# Altium project S7CAS-PLEIADES-CARTE-FILLE.PrjPCB (part 2 of 2)

## Sheet CF_FMC_DE.SchDoc
size Tabloid; DocumentNumber: 10; SheetNumber: 10; SheetTotal: 10; Sheet_Name: CF_FMC_DE; Size: 11x17
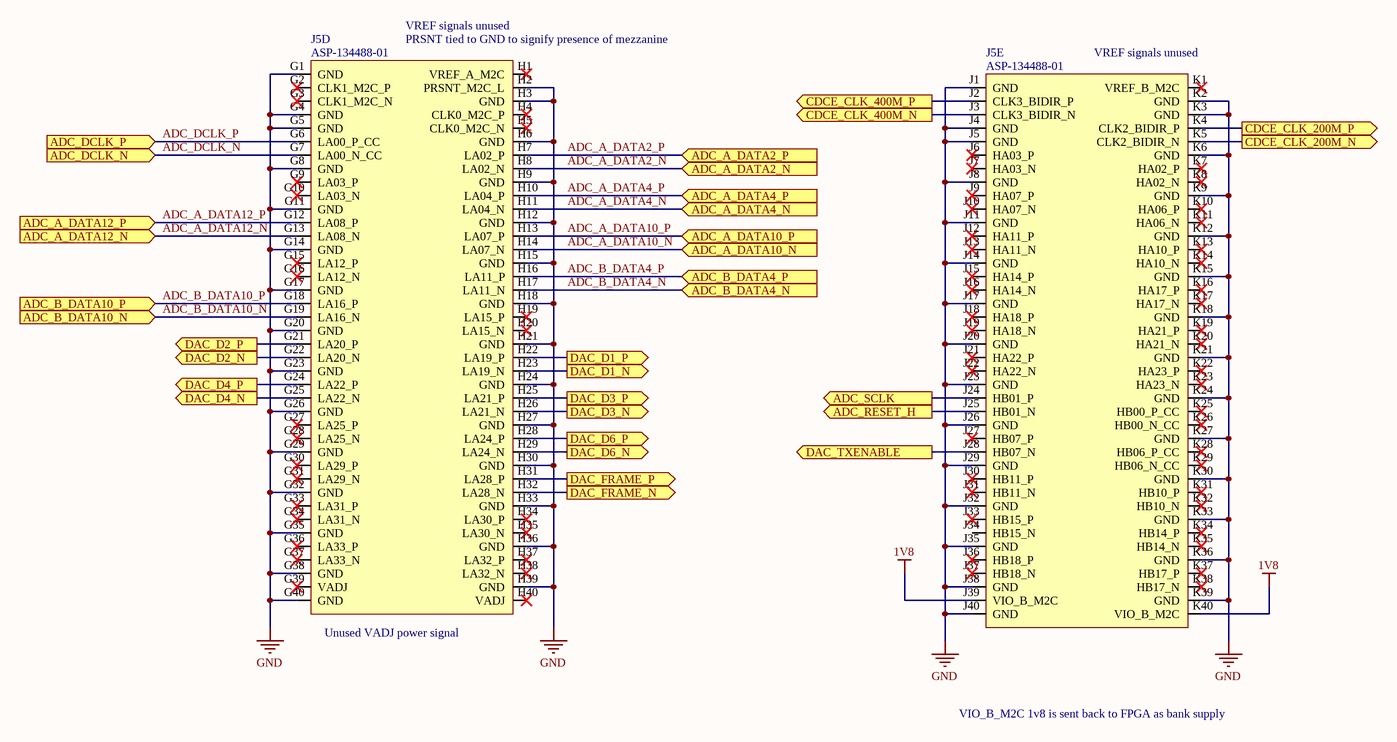
[diagram p9: CF_FMC_DE.SchDoc]

### Parts
J5  ASP-134488-01  [CONN_SAMTEC_ASP-134488-01]  (parts D,E of 5)

### Ports
ADC_A_DATA2_N (in), ADC_A_DATA2_P (in), ADC_A_DATA4_N (in), ADC_A_DATA4_P (in), ADC_A_DATA10_N (in), ADC_A_DATA10_P (in), ADC_A_DATA12_N (in), ADC_A_DATA12_P (in), ADC_B_DATA4_N (in), ADC_B_DATA4_P (in), ADC_B_DATA10_N (in), ADC_B_DATA10_P (in), ADC_DCLK_N (in), ADC_DCLK_P (in), ADC_RESET_H (out), ADC_SCLK (out), CDCE_CLK_200M_N (out), CDCE_CLK_200M_P (out), CDCE_CLK_400M_N (out), CDCE_CLK_400M_P (out), DAC_D1_N (out), DAC_D1_P (out), DAC_D2_N (out), DAC_D2_P (out), DAC_D3_N (out), DAC_D3_P (out), DAC_D4_N (out), DAC_D4_P (out), DAC_D6_N (out), DAC_D6_P (out), DAC_FRAME_N (out), DAC_FRAME_P (out), DAC_TXENABLE (out)

### Nets
1V8: J5.J39(VIO_B_M2C) J5.K40(VIO_B_M2C)
GND: J5.G1(GND) J5.G4(GND) J5.G5(GND) J5.G8(GND) J5.G11(GND) J5.G14(GND) J5.G17(GND) J5.G20(GND) J5.G23(GND) J5.G26(GND) J5.G29(GND) J5.G32(GND) J5.G35(GND) J5.G38(GND) J5.G40(GND) J5.H2(PRSNT_M2C_L) J5.H3(GND) J5.H6(GND) J5.H9(GND) J5.H12(GND) J5.H15(GND) J5.H18(GND) J5.H21(GND) J5.H24(GND) J5.H27(GND) J5.H30(GND) J5.H33(GND) J5.H36(GND) J5.H39(GND) J5.J1(GND) J5.J4(GND) J5.J5(GND) J5.J8(GND) J5.J11(GND) J5.J14(GND) J5.J17(GND) J5.J20(GND) J5.J23(GND) J5.J26(GND) J5.J29(GND) J5.J32(GND) J5.J35(GND) J5.J38(GND) J5.J40(GND) J5.K2(GND) J5.K3(GND) J5.K6(GND) J5.K9(GND) J5.K12(GND) J5.K15(GND) J5.K18(GND) J5.K21(GND) J5.K24(GND) J5.K27(GND) J5.K30(GND) J5.K33(GND) J5.K36(GND) J5.K39(GND)
ADC_A_DATA2_N: J5.H8(LA02_N) ; port ADC_A_DATA2_N
ADC_A_DATA2_P: J5.H7(LA02_P) ; port ADC_A_DATA2_P
ADC_A_DATA4_N: J5.H11(LA04_N) ; port ADC_A_DATA4_N
ADC_A_DATA4_P: J5.H10(LA04_P) ; port ADC_A_DATA4_P
ADC_A_DATA10_N: J5.H14(LA07_N) ; port ADC_A_DATA10_N
ADC_A_DATA10_P: J5.H13(LA07_P) ; port ADC_A_DATA10_P
ADC_A_DATA12_N: J5.G13(LA08_N) ; port ADC_A_DATA12_N
ADC_A_DATA12_P: J5.G12(LA08_P) ; port ADC_A_DATA12_P
ADC_B_DATA4_N: J5.H17(LA11_N) ; port ADC_B_DATA4_N
ADC_B_DATA4_P: J5.H16(LA11_P) ; port ADC_B_DATA4_P
ADC_B_DATA10_N: J5.G19(LA16_N) ; port ADC_B_DATA10_N
ADC_B_DATA10_P: J5.G18(LA16_P) ; port ADC_B_DATA10_P
ADC_DCLK_N: J5.G7(LA00_N_CC) ; port ADC_DCLK_N
ADC_DCLK_P: J5.G6(LA00_P_CC) ; port ADC_DCLK_P
DAC_D1_N: J5.H23(LA19_N) ; port DAC_D1_N
DAC_D1_P: J5.H22(LA19_P) ; port DAC_D1_P
DAC_D2_N: J5.G22(LA20_N) ; port DAC_D2_N
DAC_D2_P: J5.G21(LA20_P) ; port DAC_D2_P
DAC_D3_N: J5.H26(LA21_N) ; port DAC_D3_N
DAC_D3_P: J5.H25(LA21_P) ; port DAC_D3_P
DAC_D4_N: J5.G25(LA22_N) ; port DAC_D4_N
DAC_D4_P: J5.G24(LA22_P) ; port DAC_D4_P
DAC_D6_N: J5.H29(LA24_N) ; port DAC_D6_N
DAC_D6_P: J5.H28(LA24_P) ; port DAC_D6_P
DAC_FRAME_N: J5.H32(LA28_N) ; port DAC_FRAME_N
DAC_FRAME_P: J5.H31(LA28_P) ; port DAC_FRAME_P
REFCLK_N: J5.J3(CLK3_BIDIR_N) ; port CDCE_CLK_400M_N
REFCLK_P: J5.J2(CLK3_BIDIR_P) ; port CDCE_CLK_400M_P
NetC1_2: J5.K4(CLK2_BIDIR_P) ; port CDCE_CLK_200M_P
NetC2_2: J5.K5(CLK2_BIDIR_N) ; port CDCE_CLK_200M_N
NetJ5_J24: J5.J24(HB01_P) ; port ADC_SCLK
NetJ5_J25: J5.J25(HB01_N) ; port ADC_RESET_H
NetJ5_J28: J5.J28(HB07_N) ; port DAC_TXENABLE

Not connected (* = marked no-connect by the designer): J5 G2(CLK1_M2C_P)* G3(CLK1_M2C_N)* G9(LA03_P)* G10(LA03_N)* G15(LA12_P)* G16(LA12_N)* G27(LA25_P)* G28(LA25_N)* G30(LA29_P)* G31(LA29_N)* G33(LA31_P)* G34(LA31_N)* G36(LA33_P)* G37(LA33_N)* G39(VADJ)* H1(VREF_A_M2C)* H4(CLK0_M2C_P)* H5(CLK0_M2C_N)* H19(LA15_P)* H20(LA15_N)* H34(LA30_P)* H35(LA30_N)* H37(LA32_P)* H38(LA32_N)* H40(VADJ)* J6(HA03_P)* J7(HA03_N)* J9(HA07_P)* J10(HA07_N)* J12(HA11_P)* J13(HA11_N)* J15(HA14_P)* J16(HA14_N)* J18(HA18_P)* J19(HA18_N)* J21(HA22_P)* J22(HA22_N)* J27(HB07_P)* J30(HB11_P)* J31(HB11_N)* J33(HB15_P)* J34(HB15_N) J36(HB18_P)* J37(HB18_N)* K1(VREF_B_M2C)* K7(HA02_P)* K8(HA02_N)* K10(HA06_P)* K11(HA06_N)* K13(HA10_P)* K14(HA10_N)* K16(HA17_P)* K17(HA17_N)* K19(HA21_P)* K20(HA21_N)* K22(HA23_P)* K23(HA23_N)* K25(HB00_P_CC)* K26(HB00_N_CC)* K28(HB06_P_CC)* K29(HB06_N_CC)* K31(HB10_P)* K32(HB10_N)* K34(HB14_P)* K35(HB14_N)* K37(HB17_P)* K38(HB17_N)*

### Notes on the sheet
- (near J5) VREF signals unused
- (near J5) PRSNT tied to GND to signify presence of mezzanine
- (near J5) Unused VADJ power signal
- VIO_B_M2C 1v8 is sent back to FPGA as bank supply
- Sheet Name
- Project Title
- Global Project
- Size
- Group
- Revision
- Date
- Sheet
- of
- Filename
- Designers

### Library data of the parts
J5 = CONN_SAMTEC_ASP-134488-01: CONN - VITA 57 MEZZ MALE (DAUGHTERBOARD) HIGH DENSITY - SMD-400; Voltage: 240VAC; Current: 1.8A; Mfg: Samtec; Power: *; Mfg Part Number: ASP-134488-01; HelpURL: http://suddendocs.samtec.com/prints/asp-134488-01-mkt.pdf; CreatedBy: Jonathan Bouchard; Temperature: -55 °C to +125 °C; Value: *; Precision: *; Package: SMD-400

## Nets that join several sheets
1V8: CF_ALIM (11 pins), CF_DAC (20 pins), CF_ADC_Supply (14 pins), CF_FMC_DE (J5.J39 J5.K40)
3V3: CF_DAC (R45.2), CF_FMC_ABC (5 pins)
3V3_CLEAN: CF_ALIM (C57.2 U6.1 U6.3 U6.20), CF_DAC (C73.2 L7.2), CF_ADC_Supply (C27.2 L5.2)
12V0: CF_ALIM (6 pins), CF_FMC_ABC (J5.C35 J5.C37)
GND: CF_Title (MH1.1 MH2.1 MH3.1 MH4.1), CF_ALIM (43 pins), CF_DAC (23 pins), CF_DAC_FILTER (44 pins), CF_ADC_Supply (28 pins), CF_ADC_filter (32 pins), CF_FMC_ABC (102 pins), CF_FMC_DE (58 pins)
N5V0: CF_ALIM (5 pins), CF_DAC_FILTER (12 pins), CF_ADC_filter (14 pins)
P5V0: CF_ALIM (C64.2 U8.1 U8.3 U8.20), CF_DAC_FILTER (12 pins), CF_ADC_filter (14 pins)
ADC_A_DATA0_N: CF_ADC (U1.60), CF_FMC_ABC (J5.D9)
ADC_A_DATA0_P: CF_ADC (U1.61), CF_FMC_ABC (J5.D8)
ADC_A_DATA2_N: CF_ADC (U1.62), CF_FMC_DE (J5.H8)
ADC_A_DATA2_P: CF_ADC (U1.63), CF_FMC_DE (J5.H7)
ADC_A_DATA4_N: CF_ADC (U1.2), CF_FMC_DE (J5.H11)
ADC_A_DATA4_P: CF_ADC (U1.3), CF_FMC_DE (J5.H10)
ADC_A_DATA6_N: CF_ADC (U1.4), CF_FMC_ABC (J5.D12)
ADC_A_DATA6_P: CF_ADC (U1.5), CF_FMC_ABC (J5.D11)
ADC_A_DATA8_N: CF_ADC (U1.6), CF_FMC_ABC (J5.C11)
ADC_A_DATA8_P: CF_ADC (U1.7), CF_FMC_ABC (J5.C10)
ADC_A_DATA10_N: CF_ADC (U1.8), CF_FMC_DE (J5.H14)
ADC_A_DATA10_P: CF_ADC (U1.9), CF_FMC_DE (J5.H13)
ADC_A_DATA12_N: CF_ADC (U1.10), CF_FMC_DE (J5.G13)
ADC_A_DATA12_P: CF_ADC (U1.11), CF_FMC_DE (J5.G12)
ADC_B_DATA0_N: CF_ADC (U1.40), CF_FMC_ABC (J5.D15)
ADC_B_DATA0_P: CF_ADC (U1.41), CF_FMC_ABC (J5.D14)
ADC_B_DATA2_N: CF_ADC (U1.42), CF_FMC_ABC (J5.C15)
ADC_B_DATA2_P: CF_ADC (U1.43), CF_FMC_ABC (J5.C14)
ADC_B_DATA4_N: CF_ADC (U1.44), CF_FMC_DE (J5.H17)
ADC_B_DATA4_P: CF_ADC (U1.45), CF_FMC_DE (J5.H16)
ADC_B_DATA6_N: CF_ADC (U1.46), CF_FMC_ABC (J5.D18)
ADC_B_DATA6_P: CF_ADC (U1.47), CF_FMC_ABC (J5.D17)
ADC_B_DATA8_N: CF_ADC (U1.50), CF_FMC_ABC (J5.C19)
ADC_B_DATA8_P: CF_ADC (U1.51), CF_FMC_ABC (J5.C18)
ADC_B_DATA10_N: CF_ADC (U1.52), CF_FMC_DE (J5.G19)
ADC_B_DATA10_P: CF_ADC (U1.53), CF_FMC_DE (J5.G18)
ADC_B_DATA12_N: CF_ADC (U1.54), CF_FMC_ABC (J5.D21)
ADC_B_DATA12_P: CF_ADC (U1.55), CF_FMC_ABC (J5.D20)
ADC_DCLK_N: CF_ADC (U1.56), CF_FMC_DE (J5.G7)
ADC_DCLK_P: CF_ADC (U1.57), CF_FMC_DE (J5.G6)
ADC_IN0_N: CF_ADC (R4.2), CF_ADC_filter (L2.2 R8.1)
ADC_IN0_P: CF_ADC (R3.2), CF_ADC_filter (L1.2 R8.2)
ADC_IN1_N: CF_ADC (R6.2), CF_ADC_filter (L4.2 R15.1)
ADC_IN1_P: CF_ADC (R5.2), CF_ADC_filter (L3.2 R15.2)
ADC_VCOM: CF_ADC (U1.23), CF_ADC_filter (6 pins)
DAC_D0_N: CF_DAC (R30.1 U9.28), CF_FMC_ABC (J5.C23)
DAC_D0_P: CF_DAC (R30.2 U9.27), CF_FMC_ABC (J5.C22)
DAC_D1_N: CF_DAC (R31.1 U9.26), CF_FMC_DE (J5.H23)
DAC_D1_P: CF_DAC (R31.2 U9.25), CF_FMC_DE (J5.H22)
DAC_D2_N: CF_DAC (R32.1 U9.24), CF_FMC_DE (J5.G22)
DAC_D2_P: CF_DAC (R32.2 U9.23), CF_FMC_DE (J5.G21)
DAC_D3_N: CF_DAC (R33.1 U9.22), CF_FMC_DE (J5.H26)
DAC_D3_P: CF_DAC (R33.2 U9.21), CF_FMC_DE (J5.H25)
DAC_D4_N: CF_DAC (R35.1 U9.16), CF_FMC_DE (J5.G25)
DAC_D4_P: CF_DAC (R35.2 U9.15), CF_FMC_DE (J5.G24)
DAC_D5_N: CF_DAC (R36.1 U9.14), CF_FMC_ABC (J5.D24)
DAC_D5_P: CF_DAC (R36.2 U9.13), CF_FMC_ABC (J5.D23)
DAC_D6_N: CF_DAC (R40.1 U9.12), CF_FMC_DE (J5.H29)
DAC_D6_P: CF_DAC (R40.2 U9.11), CF_FMC_DE (J5.H28)
DAC_D7_N: CF_DAC (R42.1 U9.10), CF_FMC_ABC (J5.D27)
DAC_D7_P: CF_DAC (R42.2 U9.9), CF_FMC_ABC (J5.D26)
DAC_DCI_N: CF_DAC (R43.1 U9.18), CF_FMC_ABC (J5.C27)
DAC_DCI_P: CF_DAC (R43.2 U9.17), CF_FMC_ABC (J5.C26)
DAC_FRAME_N: CF_DAC (R46.1 U9.20), CF_FMC_DE (J5.H32)
DAC_FRAME_P: CF_DAC (R46.2 U9.19), CF_FMC_DE (J5.H31)
DAC_OUT0_N: CF_DAC (R34.1 U9.46), CF_DAC_FILTER (C103.1 L9.1 R54.1)
DAC_OUT0_P: CF_DAC (R34.2 U9.47), CF_DAC_FILTER (C102.2 L8.1 R52.2)
DAC_OUT1_N: CF_DAC (R41.1 U9.39), CF_DAC_FILTER (C105.1 L11.1 R62.1)
DAC_OUT1_P: CF_DAC (R41.2 U9.38), CF_DAC_FILTER (C104.2 L10.1 R60.2)
NetC1_2: CF_ADC (C1.2 R1.2), CF_FMC_DE (J5.K4)
NetC2_2: CF_ADC (C2.2 R1.1), CF_FMC_DE (J5.K5)
NetJ5_E21: CF_DAC (R37.1 U9.36), CF_FMC_ABC (J5.E21)
NetJ5_E22: CF_ADC (R2.1), CF_FMC_ABC (J5.E22)
NetJ5_E24: CF_DAC (R39.1 U9.34), CF_FMC_ABC (J5.E24)
NetJ5_E25: CF_DAC (R38.1 U9.33), CF_FMC_ABC (J5.E25)
NetJ5_F22: CF_ADC (U1.14), CF_FMC_ABC (J5.F22)
NetJ5_F23: CF_ADC (U1.15), CF_FMC_ABC (J5.F23)
NetJ5_F25: CF_DAC (U9.31), CF_FMC_ABC (J5.F25)
NetJ5_F26: CF_DAC (U9.32), CF_FMC_ABC (J5.F26)
NetJ5_J24: CF_ADC (U1.13), CF_FMC_DE (J5.J24)
NetJ5_J25: CF_ADC (U1.12), CF_FMC_DE (J5.J25)
NetJ5_J28: CF_DAC (U9.30), CF_FMC_DE (J5.J28)
REFCLK_N: CF_DAC (R48.1 U9.7), CF_FMC_DE (J5.J3)
REFCLK_P: CF_DAC (R48.2 U9.6), CF_FMC_DE (J5.J2)